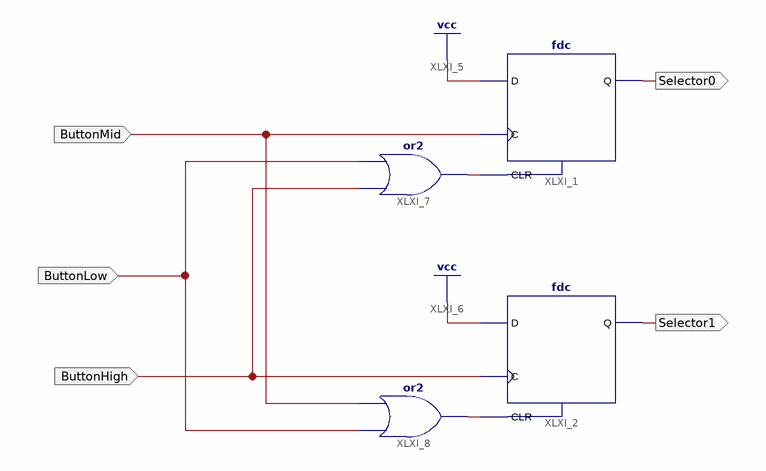
[diagram p0: schematic sheet 1]
// Xilinx ISE schematic OctaveSelector.sch (spartan6) as structural Verilog: 4 symbols, 5 ports
module OctaveSelector (
  input  ButtonLow,
  input  ButtonHigh,
  input  ButtonMid,
  output Selector0,
  output Selector1
);

  wire XLXN_21, XLXN_22;

  fdc XLXI_1 (.C(ButtonMid), .CLR(XLXN_21), .D(1'b1), .Q(Selector0));
  fdc XLXI_2 (.C(ButtonHigh), .CLR(XLXN_22), .D(1'b1), .Q(Selector1));
  or XLXI_7 (XLXN_21, ButtonHigh, ButtonLow);
  or XLXI_8 (XLXN_22, ButtonLow, ButtonMid);
endmodule
